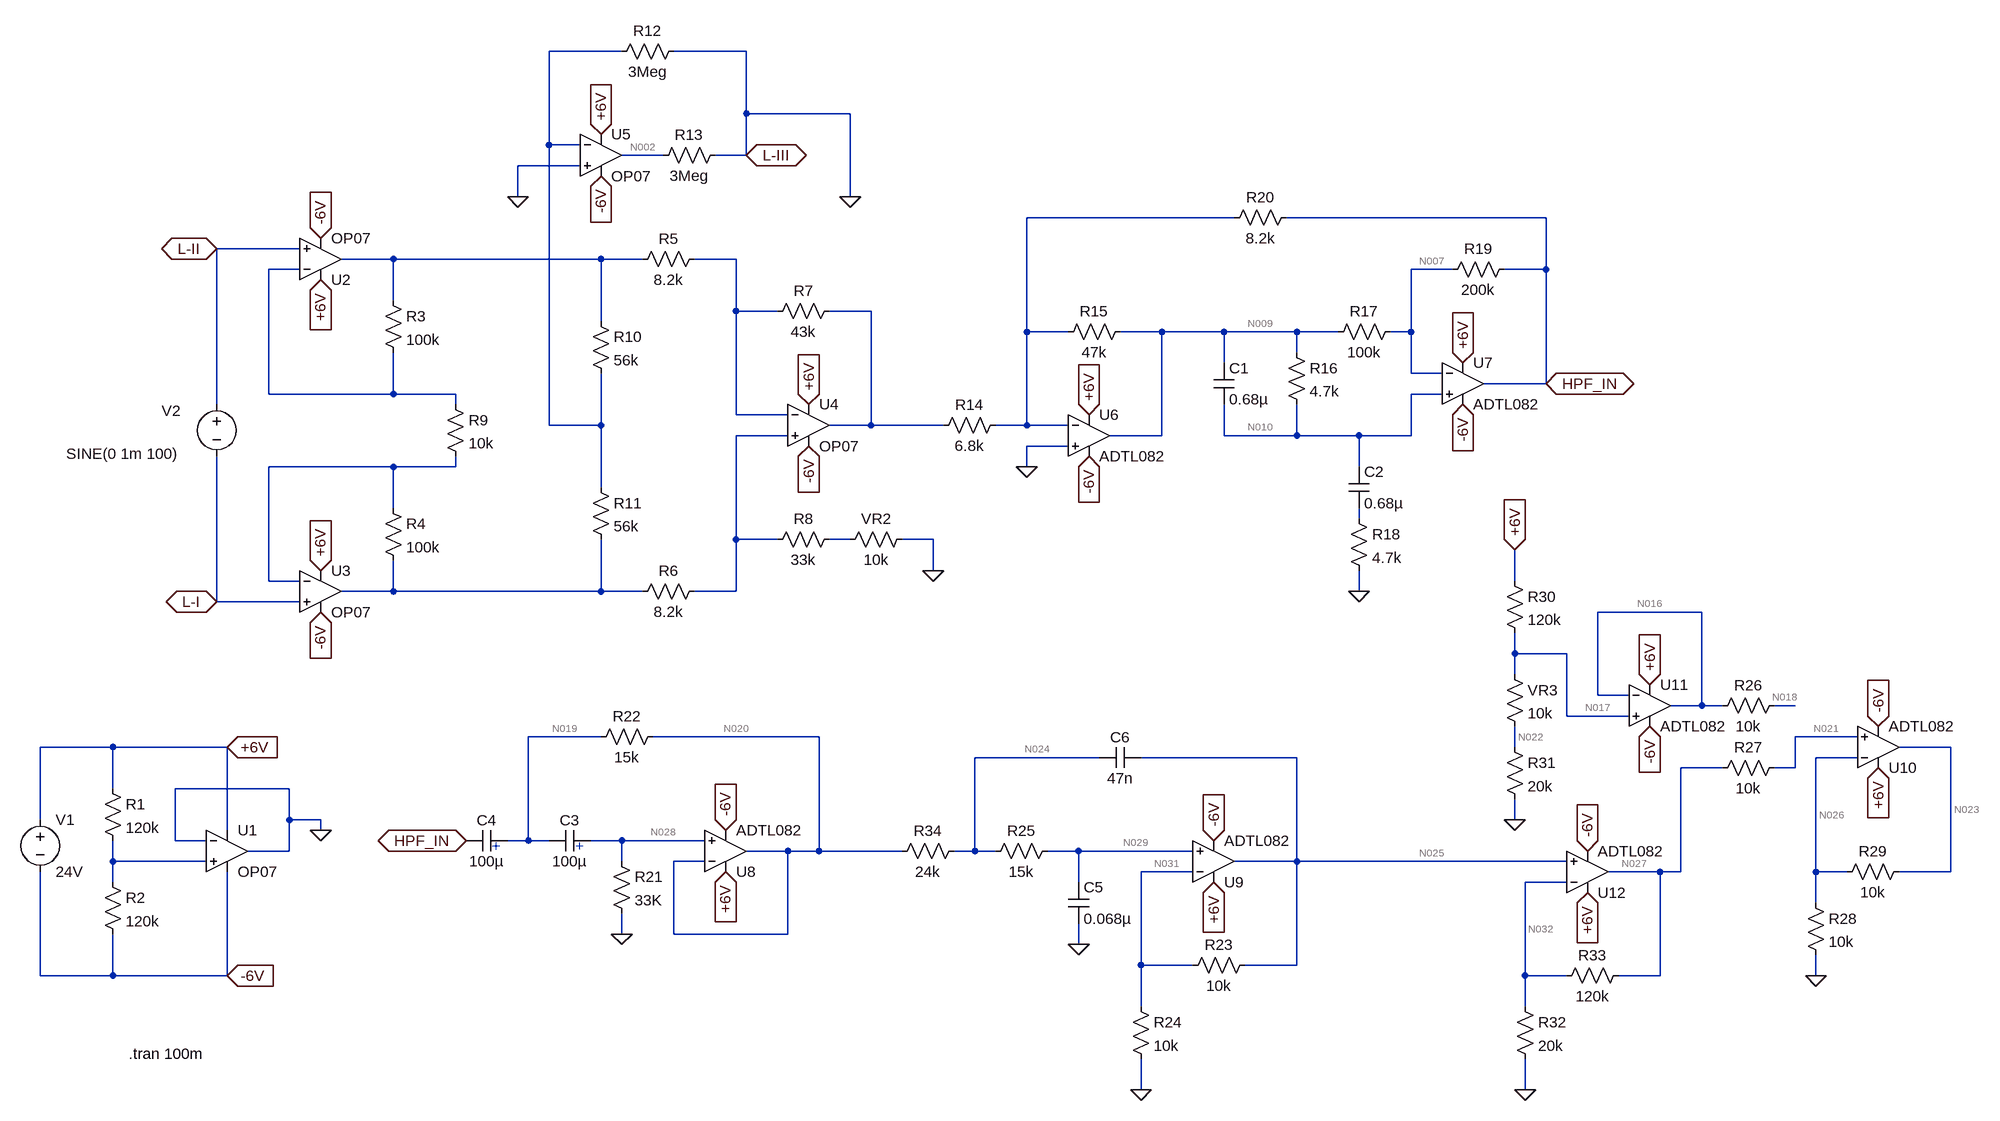
[diagram p0: schematic Final.asc]
Final.asc, the LTspice schematic file:
Version 4
SHEET 1 5108 1308
WIRE 32 -848 -80 -848
WIRE 224 -848 112 -848
WIRE 224 -752 224 -848
WIRE 384 -752 224 -752
WIRE -80 -704 -80 -848
WIRE -32 -704 -80 -704
WIRE 96 -688 32 -688
WIRE 224 -688 224 -752
WIRE 224 -688 176 -688
WIRE -32 -672 -128 -672
WIRE -128 -624 -128 -672
WIRE 384 -624 384 -752
WIRE 976 -592 656 -592
WIRE 1456 -592 1056 -592
WIRE -464 -544 -592 -544
WIRE -320 -528 -400 -528
WIRE 0 -528 -320 -528
WIRE 64 -528 0 -528
WIRE 208 -528 144 -528
WIRE -464 -512 -512 -512
WIRE 1312 -512 1248 -512
WIRE 1456 -512 1456 -592
WIRE 1456 -512 1392 -512
WIRE -320 -464 -320 -528
WIRE 208 -448 208 -528
WIRE 272 -448 208 -448
WIRE 416 -448 352 -448
WIRE 0 -432 0 -528
WIRE 656 -416 656 -592
WIRE 720 -416 656 -416
WIRE 864 -416 800 -416
WIRE 960 -416 864 -416
WIRE 1072 -416 960 -416
WIRE 1136 -416 1072 -416
WIRE 1248 -416 1248 -512
WIRE 1248 -416 1216 -416
WIRE 1072 -384 1072 -416
WIRE 960 -368 960 -416
WIRE 1248 -352 1248 -416
WIRE 1296 -352 1248 -352
WIRE 1456 -336 1456 -512
WIRE 1456 -336 1360 -336
WIRE -512 -320 -512 -512
WIRE -320 -320 -320 -384
WIRE -320 -320 -512 -320
WIRE -224 -320 -320 -320
WIRE 1296 -320 1248 -320
WIRE -592 -304 -592 -544
WIRE -224 -304 -224 -320
WIRE 208 -288 208 -448
WIRE 288 -288 208 -288
WIRE -80 -272 -80 -704
WIRE 0 -272 0 -352
WIRE 0 -272 -80 -272
WIRE 416 -272 416 -448
WIRE 416 -272 352 -272
WIRE 528 -272 416 -272
WIRE 656 -272 656 -416
WIRE 656 -272 608 -272
WIRE 720 -272 656 -272
WIRE 288 -256 208 -256
WIRE 864 -256 864 -416
WIRE 864 -256 784 -256
WIRE 960 -256 960 -304
WIRE 1072 -256 1072 -304
WIRE 1072 -256 960 -256
WIRE 1168 -256 1072 -256
WIRE 1248 -256 1248 -320
WIRE 1248 -256 1168 -256
WIRE 720 -240 656 -240
WIRE -320 -208 -512 -208
WIRE -224 -208 -224 -224
WIRE -224 -208 -320 -208
WIRE 656 -208 656 -240
WIRE 1168 -208 1168 -256
WIRE 0 -176 0 -272
WIRE -320 -144 -320 -208
WIRE 1168 -128 1168 -144
WIRE 208 -96 208 -256
WIRE 272 -96 208 -96
WIRE 384 -96 352 -96
WIRE 512 -96 464 -96
WIRE 512 -48 512 -96
WIRE -512 -32 -512 -208
WIRE -464 -32 -512 -32
WIRE 1408 -32 1408 -80
WIRE -320 -16 -320 -64
WIRE -320 -16 -400 -16
WIRE 0 -16 0 -96
WIRE 0 -16 -320 -16
WIRE 64 -16 0 -16
WIRE 208 -16 208 -96
WIRE 208 -16 144 -16
WIRE 1168 -16 1168 -48
WIRE -592 0 -592 -224
WIRE -464 0 -592 0
WIRE 1696 16 1536 16
WIRE 1408 80 1408 48
WIRE 1488 80 1408 80
WIRE 1408 112 1408 80
WIRE 1536 144 1536 16
WIRE 1584 144 1536 144
WIRE 1696 160 1696 16
WIRE 1696 160 1648 160
WIRE 1728 160 1696 160
WIRE 1840 160 1808 160
WIRE 1488 176 1488 80
WIRE 1584 176 1488 176
WIRE 0 208 -112 208
WIRE 336 208 80 208
WIRE 1936 208 1840 208
WIRE -752 224 -864 224
WIRE -576 224 -752 224
WIRE 1408 224 1408 192
WIRE 2080 224 2000 224
WIRE 768 240 576 240
WIRE 1072 240 832 240
WIRE 1936 240 1872 240
WIRE 1728 256 1664 256
WIRE 1840 256 1840 208
WIRE 1840 256 1808 256
WIRE -752 288 -752 224
WIRE -480 288 -656 288
WIRE -864 336 -864 224
WIRE -480 336 -480 288
WIRE -432 336 -480 336
WIRE 1408 336 1408 304
WIRE -576 352 -576 224
WIRE -432 352 -432 336
WIRE -656 368 -656 288
WIRE -608 368 -656 368
WIRE -112 368 -112 208
WIRE -112 368 -144 368
WIRE -80 368 -112 368
WIRE 32 368 -16 368
WIRE 160 368 32 368
WIRE -480 384 -480 336
WIRE -480 384 -544 384
WIRE 288 384 224 384
WIRE 336 384 336 208
WIRE 336 384 288 384
WIRE 464 384 336 384
WIRE 576 384 576 240
WIRE 576 384 544 384
WIRE 608 384 576 384
WIRE 736 384 688 384
WIRE 912 384 736 384
WIRE -752 400 -752 368
WIRE -608 400 -752 400
WIRE 32 400 32 368
WIRE 160 400 112 400
WIRE 1072 400 1072 240
WIRE 1072 400 976 400
WIRE 1488 400 1072 400
WIRE 912 416 832 416
WIRE 1632 416 1552 416
WIRE 1664 416 1664 256
WIRE 1664 416 1632 416
WIRE 1872 416 1872 240
WIRE 1920 416 1872 416
WIRE 2080 416 2080 224
WIRE 2080 416 2000 416
WIRE -752 432 -752 400
WIRE 736 432 736 384
WIRE 1488 432 1424 432
WIRE 1872 464 1872 416
WIRE 32 512 32 480
WIRE 112 512 112 400
WIRE 288 512 288 384
WIRE 288 512 112 512
WIRE 736 528 736 496
WIRE 832 560 832 416
WIRE 912 560 832 560
WIRE 1072 560 1072 400
WIRE 1072 560 992 560
WIRE -864 576 -864 416
WIRE -752 576 -752 512
WIRE -752 576 -864 576
WIRE -576 576 -576 416
WIRE -576 576 -752 576
WIRE 1424 576 1424 432
WIRE 1488 576 1424 576
WIRE 1632 576 1632 416
WIRE 1632 576 1568 576
WIRE 1872 576 1872 544
WIRE 832 624 832 560
WIRE 1424 624 1424 576
WIRE 832 752 832 704
WIRE 1424 752 1424 704
FLAG -432 352 0
FLAG 512 -48 0
FLAG -128 -624 0
FLAG -592 -544 L-II
IOPIN -592 -544 BiDir
FLAG -592 0 L-I
IOPIN -592 0 BiDir
FLAG 224 -688 L-III
IOPIN 224 -688 BiDir
FLAG 656 -208 0
FLAG 1168 -16 0
FLAG 32 512 0
FLAG 1872 576 0
FLAG 1408 336 0
FLAG 1424 752 0
FLAG -432 -496 +6V
IOPIN -432 -496 In
FLAG -432 -48 +6V
IOPIN -432 -48 In
FLAG 0 -720 +6V
IOPIN 0 -720 In
FLAG 320 -304 +6V
IOPIN 320 -304 In
FLAG 752 -288 +6V
IOPIN 752 -288 In
FLAG 1328 -368 +6V
IOPIN 1328 -368 In
FLAG 192 416 +6V
IOPIN 192 416 In
FLAG 1616 128 +6V
IOPIN 1616 128 In
FLAG 1520 448 +6V
IOPIN 1520 448 In
FLAG 1968 256 +6V
IOPIN 1968 256 In
FLAG -432 -560 -6V
IOPIN -432 -560 In
FLAG -432 16 -6V
IOPIN -432 16 In
FLAG 0 -656 -6V
IOPIN 0 -656 In
FLAG 320 -240 -6V
IOPIN 320 -240 In
FLAG 752 -224 -6V
IOPIN 752 -224 In
FLAG 1328 -304 -6V
IOPIN 1328 -304 In
FLAG 192 352 -6V
IOPIN 192 352 In
FLAG 1968 192 -6V
IOPIN 1968 192 In
FLAG 1616 192 -6V
IOPIN 1616 192 In
FLAG 1520 384 -6V
IOPIN 1520 384 In
FLAG -576 576 -6V
IOPIN -576 576 In
FLAG -576 224 +6V
IOPIN -576 224 In
FLAG 1408 -80 +6V
IOPIN 1408 -80 In
FLAG 1456 -336 HPF_IN
IOPIN 1456 -336 BiDir
FLAG -208 368 HPF_IN
IOPIN -208 368 BiDir
FLAG 944 432 +6V
IOPIN 944 432 In
FLAG 944 368 -6V
IOPIN 944 368 In
FLAG 832 752 0
FLAG 736 528 0
FLAG 384 -624 0
SYMBOL voltage -864 320 R0
WINDOW 123 0 0 Left 0
WINDOW 39 0 0 Left 0
SYMATTR InstName V1
SYMATTR Value 24V
SYMBOL res -768 272 R0
SYMATTR InstName R1
SYMATTR Value 120k
SYMBOL res -768 416 R0
SYMATTR InstName R2
SYMATTR Value 120k
SYMBOL OP07 -576 320 R0
SYMATTR InstName U1
SYMBOL res -336 -480 R0
SYMATTR InstName R3
SYMATTR Value 100k
SYMBOL res -336 -160 R0
SYMATTR InstName R4
SYMATTR Value 100k
SYMBOL OP07 -432 -464 M180
SYMATTR InstName U2
SYMBOL OP07 -432 -80 R0
SYMATTR InstName U3
SYMBOL res 160 -544 R90
WINDOW 0 0 56 VBottom 2
WINDOW 3 32 56 VTop 2
SYMATTR InstName R5
SYMATTR Value 8.2k
SYMBOL res 160 -32 R90
WINDOW 0 0 56 VBottom 2
WINDOW 3 32 56 VTop 2
SYMATTR InstName R6
SYMATTR Value 8.2k
SYMBOL OP07 320 -336 R0
SYMATTR InstName U4
SYMBOL res 368 -464 R90
WINDOW 0 0 56 VBottom 2
WINDOW 3 32 56 VTop 2
SYMATTR InstName R7
SYMATTR Value 43k
SYMBOL res 368 -112 R90
WINDOW 0 0 56 VBottom 2
WINDOW 3 32 56 VTop 2
SYMATTR InstName R8
SYMATTR Value 33k
SYMBOL res 480 -112 R90
WINDOW 0 0 56 VBottom 2
WINDOW 3 32 56 VTop 2
SYMATTR InstName VR2
SYMATTR Value 10k
SYMBOL res -240 -320 R0
SYMATTR InstName R9
SYMATTR Value 10k
SYMATTR SpiceLine tol=1 pwr=0.25
SYMBOL res -16 -448 R0
SYMATTR InstName R10
SYMATTR Value 56k
SYMBOL res -16 -192 R0
SYMATTR InstName R11
SYMATTR Value 56k
SYMBOL OP07 0 -752 R0
SYMATTR InstName U5
SYMBOL res 128 -864 R90
WINDOW 0 0 56 VBottom 2
WINDOW 3 32 56 VTop 2
SYMATTR InstName R12
SYMATTR Value 3Meg
SYMBOL res 192 -704 R90
WINDOW 0 0 56 VBottom 2
WINDOW 3 32 56 VTop 2
SYMATTR InstName R13
SYMATTR Value 3Meg
SYMBOL ADTL082 752 -320 R0
SYMATTR InstName U6
SYMBOL ADTL082 1328 -400 R0
SYMATTR InstName U7
SYMBOL res 624 -288 R90
WINDOW 0 0 56 VBottom 2
WINDOW 3 32 56 VTop 2
SYMATTR InstName R14
SYMATTR Value 6.8k
SYMBOL res 816 -432 R90
WINDOW 0 0 56 VBottom 2
WINDOW 3 32 56 VTop 2
SYMATTR InstName R15
SYMATTR Value 47k
SYMBOL cap 944 -368 R0
SYMATTR InstName C1
SYMATTR Value 0.68µ
SYMBOL res 1056 -400 R0
SYMATTR InstName R16
SYMATTR Value 4.7k
SYMBOL res 1232 -432 R90
WINDOW 0 0 56 VBottom 2
WINDOW 3 32 56 VTop 2
SYMATTR InstName R17
SYMATTR Value 100k
SYMBOL cap 1152 -208 R0
SYMATTR InstName C2
SYMATTR Value 0.68µ
SYMBOL res 1152 -144 R0
SYMATTR InstName R18
SYMATTR Value 4.7k
SYMBOL res 1408 -528 R90
WINDOW 0 0 56 VBottom 2
WINDOW 3 32 56 VTop 2
SYMATTR InstName R19
SYMATTR Value 200k
SYMBOL res 1072 -608 R90
WINDOW 0 0 56 VBottom 2
WINDOW 3 32 56 VTop 2
SYMATTR InstName R20
SYMATTR Value 8.2k
SYMBOL ADTL082 192 448 M180
SYMATTR InstName U8
SYMBOL res 16 384 R0
SYMATTR InstName R21
SYMATTR Value 33K
SYMBOL cap -16 352 R90
WINDOW 0 0 32 VBottom 2
WINDOW 3 32 32 VTop 2
SYMATTR InstName C3
SYMATTR Value 100µ
SYMBOL cap -144 352 R90
WINDOW 0 0 32 VBottom 2
WINDOW 3 32 32 VTop 2
SYMATTR InstName C4
SYMATTR Value 100µ
SYMBOL res 96 192 R90
WINDOW 0 0 56 VBottom 2
WINDOW 3 32 56 VTop 2
SYMATTR InstName R22
SYMATTR Value 15k
SYMBOL ADTL082 1968 288 M180
SYMATTR InstName U10
SYMBOL res 1824 144 R90
WINDOW 0 0 56 VBottom 2
WINDOW 3 32 56 VTop 2
SYMATTR InstName R26
SYMATTR Value 10k
SYMBOL res 1824 240 R90
WINDOW 0 0 56 VBottom 2
WINDOW 3 32 56 VTop 2
SYMATTR InstName R27
SYMATTR Value 10k
SYMBOL res 1856 448 R0
SYMATTR InstName R28
SYMATTR Value 10k
SYMBOL res 2016 400 R90
WINDOW 0 0 56 VBottom 2
WINDOW 3 32 56 VTop 2
SYMATTR InstName R29
SYMATTR Value 10k
SYMBOL ADTL082 1616 96 R0
SYMATTR InstName U11
SYMBOL res 1392 -48 R0
SYMATTR InstName R30
SYMATTR Value 120k
SYMBOL res 1392 208 R0
SYMATTR InstName R31
SYMATTR Value 20k
SYMBOL ADTL082 1520 480 M180
SYMATTR InstName U12
SYMBOL res 1408 608 R0
SYMATTR InstName R32
SYMATTR Value 20k
SYMBOL res 1584 560 R90
WINDOW 0 0 56 VBottom 2
WINDOW 3 32 56 VTop 2
SYMATTR InstName R33
SYMATTR Value 120k
SYMBOL res 1392 96 R0
SYMATTR InstName VR3
SYMATTR Value 10k
SYMBOL OpAmps\\ADTL082 944 464 M180
SYMATTR InstName U9
SYMBOL res 1008 544 R90
WINDOW 0 0 56 VBottom 2
WINDOW 3 32 56 VTop 2
SYMATTR InstName R23
SYMATTR Value 10k
SYMBOL res 816 608 R0
SYMATTR InstName R24
SYMATTR Value 10k
SYMBOL cap 720 432 R0
SYMATTR InstName C5
SYMATTR Value 0.068µ
SYMBOL res 704 368 R90
WINDOW 0 0 56 VBottom 2
WINDOW 3 32 56 VTop 2
SYMATTR InstName R25
SYMATTR Value 15k
SYMBOL res 560 368 R90
WINDOW 0 0 56 VBottom 2
WINDOW 3 32 56 VTop 2
SYMATTR InstName R34
SYMATTR Value 24k
SYMBOL cap 832 224 R90
WINDOW 0 0 32 VBottom 2
WINDOW 3 32 32 VTop 2
SYMATTR InstName C6
SYMATTR Value 47n
SYMBOL voltage -592 -320 R0
WINDOW 0 -85 26 Left 2
WINDOW 3 -232 92 Left 2
WINDOW 123 0 0 Left 0
WINDOW 39 0 0 Left 0
SYMATTR InstName V2
SYMATTR Value SINE(0 1m 100)
TEXT -728 696 Left 2 !.tran 100m
TEXT -168 376 Left 2 ;+
TEXT -40 376 Left 2 ;+

The netlist it stands for:
* Final.asc
V1 +6V -6V 24V
R1 +6V N030 120k
R2 N030 -6V 120k
XU1 N030 0 +6V -6V 0 LT1001  ; OP07, pins In+ In- V+ V- OUT
R3 N004 N006 100k
R4 N012 N015 100k
XU2 L-II N006 +6V -6V N004 LT1001  ; OP07, pins In+ In- V+ V- OUT
XU3 L-I N012 +6V -6V N015 LT1001  ; OP07, pins In+ In- V+ V- OUT
R5 N005 N004 8.2k
R6 N011 N015 8.2k
XU4 N011 N005 +6V -6V N008 LT1001  ; OP07, pins In+ In- V+ V- OUT
R7 N008 N005 43k
R8 N014 N011 33k
R§VR2 0 N014 10k
R9 N006 N012 10k tol=1 pwr=0.25
R10 N004 N001 56k
R11 N001 N015 56k
XU5 0 N001 +6V -6V N002 LT1001  ; OP07, pins In+ In- V+ V- OUT
R12 0 N001 3Meg
R13 0 N002 3Meg
XU6 0 N003 +6V -6V N009 ADTL082  ; pins In+ In- V+ V- OUT
XU7 N010 N007 +6V -6V HPF_IN ADTL082  ; pins In+ In- V+ V- OUT
R14 N003 N008 6.8k
R15 N009 N003 47k
C1 N009 N010 0.68µ
R16 N009 N010 4.7k
R17 N007 N009 100k
C2 N010 N013 0.68µ
R18 N013 0 4.7k
R19 HPF_IN N007 200k
R20 HPF_IN N003 8.2k
XU8 N028 N020 +6V -6V N020 ADTL082  ; pins In+ In- V+ V- OUT
R21 N028 0 33K
C3 N028 N019 100µ
C4 N019 HPF_IN 100µ
R22 N020 N019 15k
XU10 N021 N026 +6V -6V N023 ADTL082  ; pins In+ In- V+ V- OUT
R26 N018 N016 10k
R27 N021 N027 10k
R28 N026 0 10k
R29 N023 N026 10k
XU11 N017 N016 +6V -6V N016 ADTL082  ; pins In+ In- V+ V- OUT
R30 +6V N017 120k
R31 N022 0 20k
XU12 N025 N032 +6V -6V N027 ADTL082  ; pins In+ In- V+ V- OUT
R32 N032 0 20k
R33 N027 N032 120k
R§VR3 N017 N022 10k
XU9 N029 N031 +6V -6V N025 ADTL082  ; pins In+ In- V+ V- OUT
R23 N025 N031 10k
R24 N031 0 10k
C5 N029 0 0.068µ
R25 N029 N024 15k
R34 N024 N020 24k
C6 N025 N024 47n
V2 L-II L-I SINE(0 1m 100)
.tran 100m
* +
* +
.lib LTC.lib
.lib ADI.lib
.backanno
.end

* Results of the author's LTspice run, read from the files saved beside the schematic
* Operating Point, zero values left out:
*   V(+6v) = 12 V
*   V(-6v) = -12 V
*   V(n002) = 2.656 mV
*   V(n009) = -302.6 nV
*   V(n007) = -312 nV
*   V(n010) = -312 nV
*   V(hpf_in) = 69.2 nV
*   V(n020) = -66 nV
*   V(n028) = -66 nV
*   V(n019) = -66 nV
*   V(n026) = -1.656 µV
*   V(n021) = -1.656 µV
*   V(n023) = -3.292 µV
*   V(n018) = 2.4 V
*   V(n016) = 2.4 V
*   V(n027) = -1.636 µV
*   V(n017) = 2.4 V
*   V(n022) = 1.6 V
*   V(n032) = -268 nV
*   V(n025) = -268 nV
*   V(n031) = -144 nV
*   V(n029) = -144 nV
*   V(n024) = -114 nV
*   I(R34) = -2 pA
*   I(R25) = -2 pA
*   I(R24) = -14.4 pA
*   I(R23) = -12.4 pA
*   I(Vr3) = 80 µA
*   I(R33) = -11.4 pA
*   I(R32) = -13.4 pA
*   I(R31) = 80 µA
*   I(R30) = 80 µA
*   I(R29) = -163.6 pA
*   I(R28) = -165.6 pA
*   I(R27) = -2 pA
*   I(R21) = -2 pA
*   I(R20) = 8.438 pA
*   I(R19) = 1.906 pA
*   I(R16) = 2 pA
*   I(R15) = -6.438 pA
*   I(R13) = -885.4 pA
*   I(R2) = 100 µA
*   I(R1) = 100 µA
*   I(V1) = -46.78 mA
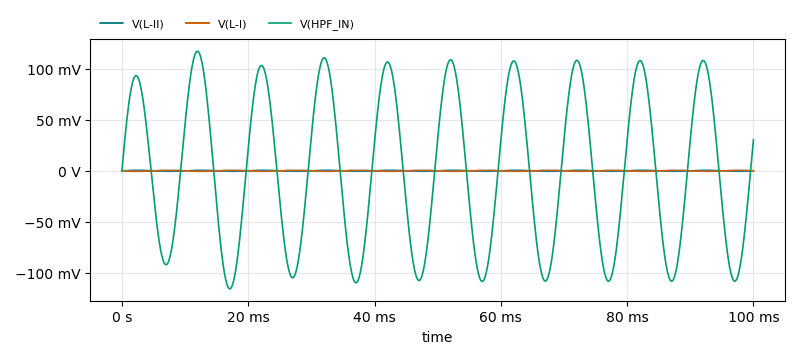
[diagram p1: Transient Analysis of Final.asc, plotted from the saved traces]
* Transient Analysis, 1 run:
*   V(L-II): min -499.5 µV, max 499.5 µV, average -89.24 nV, rms 353.2 µV, last -598.1 nV
*   V(L-I): min -500.5 µV, max 500.5 µV, average 94.54 nV, rms 353.9 µV, last -598.1 nV
*   V(HPF_IN): min -115.9 mV, max 117.4 mV, average 128.6 µV, rms 75.96 mV, last 30.31 mV